# EasyEDA Pro project ProPrj_Arduino_Contest_2025_2025-11-19.epro, board Hub_Module_Rev_0
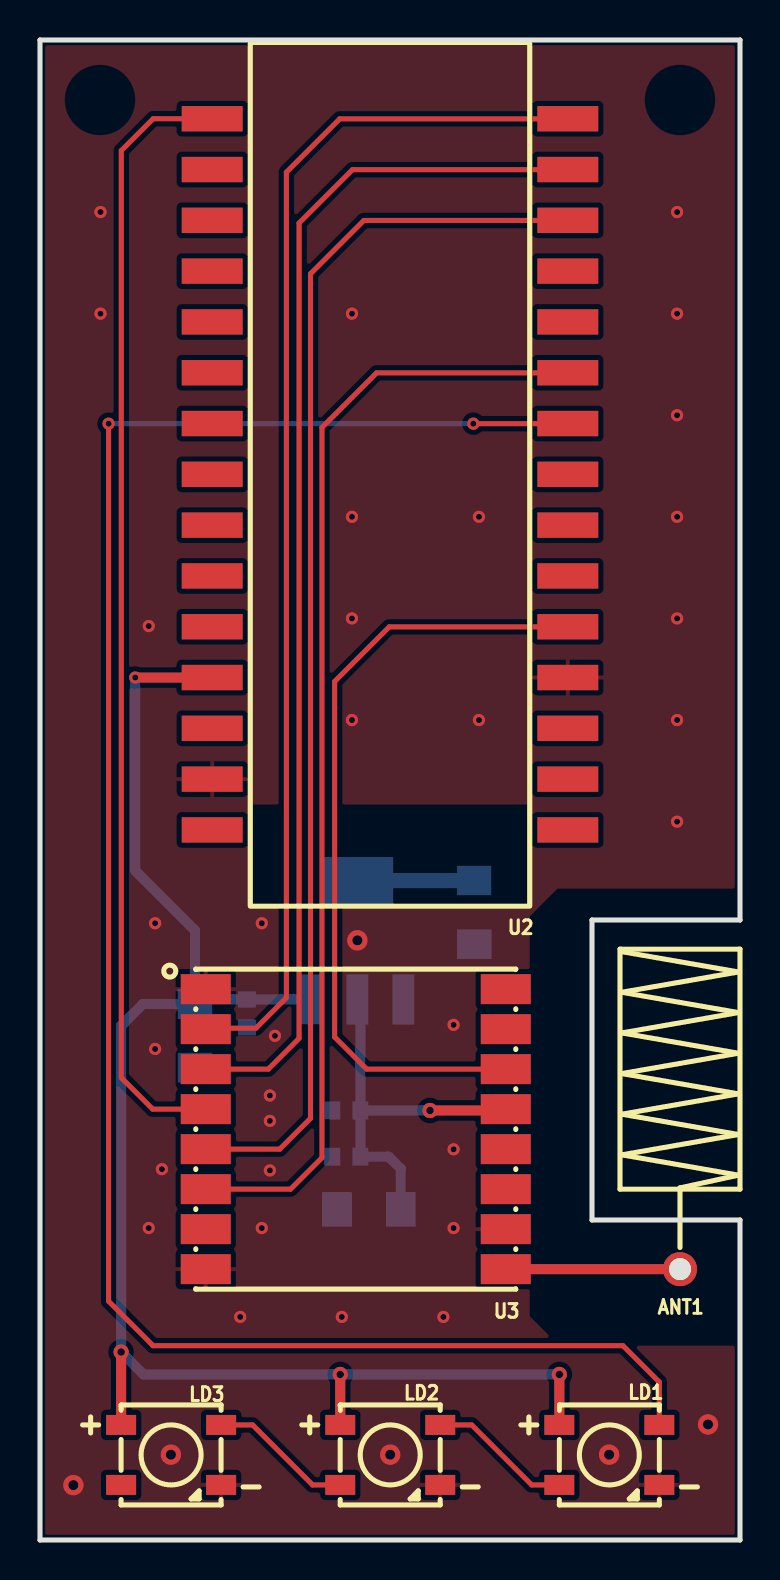
[diagram p25: board, top side]
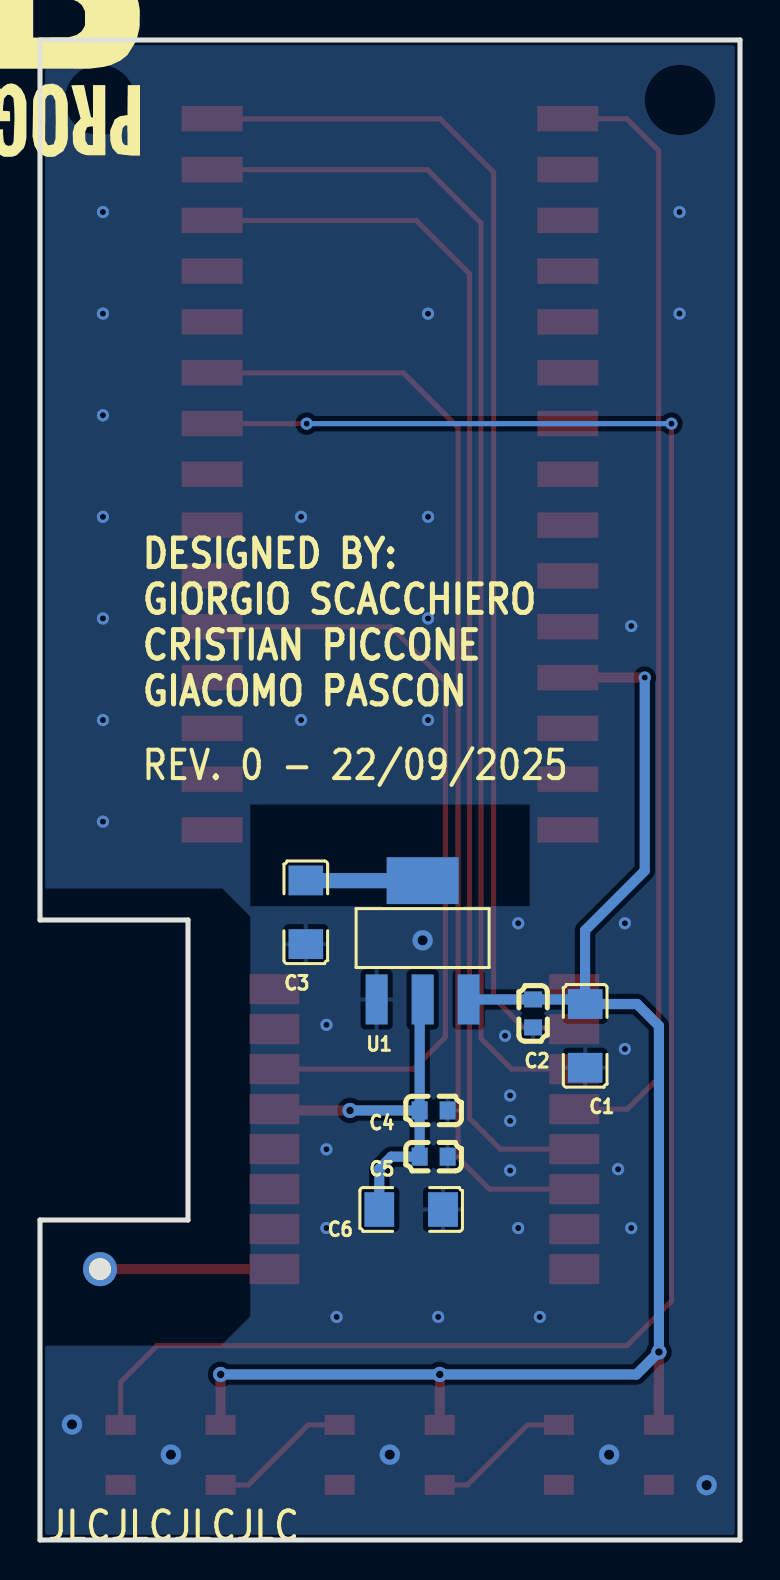
[diagram p26: board, bottom side, seen from below]

Outline 35 x 75 mm; copper layers: Top Layer, Bottom Layer. Coordinates in mm from the lower left corner of the outline.
Outline path: 0,75 35,75 35,31 27.6,31 27.6,16 35,16 35,0 0,0 0,75
Stack: Top Layer 0.035mm / Dielectric1 1.51mm FR4 er 4.5 / Bottom Layer 0.035mm

## Design rules (mm)
template: JLCPCB Capability(Two Layers Board)
spacing copperThickness1oz (default): track to track 0.102, other pairs 0.152 to 0.3
spacing copperThickness2oz: track to track 0.203, other pairs 0.152 to 0.3
track width copperThickness1oz (default): min 0.127, default 0.254, max 2.54
track width copperThickness2oz: min 0.203, default 0.254, max 2.54
differential pair differentialPair (default): width min 0.127, default 0.254, max 2.54; gap min 0.152, default 0.152
via viaSize (default): diameter min 0.5, default 0.61, max 10; hole min 0.3, default 0.305, max 6.3

## Placement (name value [footprint] x y rotation side)
ANT1  VG868SNX18-5W2  [ANT-TH_VG868SNX18-5W2]  32 13.54 90 top
C1  4.7uF  [C1206]  7.74 25.21 90 bottom
C2  100nF  [C0603]  10.34 26.33 90 bottom
C3  4.7uF  [C1206]  21.71 31.39 90 bottom
C4  100pF  [C0603]  15.32 21.48 0 bottom
C5  100nF  [C0603]  15.32 19.17 0 bottom
C6  4.7uF  [C1206]  16.44 16.53 0 bottom
LD1  XL-5050RGBC-WS2812B  [LED-SMD_4P-L5.0-W5.0-BL_XL-5050RGBC]  28.47 4.25 270 top
LD2  XL-5050RGBC-WS2812B  [LED-SMD_4P-L5.0-W5.0-BL_XL-5050RGBC]  17.51 4.25 270 top
LD3  XL-5050RGBC-WS2812B  [LED-SMD_4P-L5.0-W5.0-BL_XL-5050RGBC]  6.56 4.25 270 top
U1  AMS1117-3.3(XBLW)  [SOT-223-3_L6.5-W3.4-P2.30-LS7.0-BR-1]  15.87 30 270 bottom
U2  -  [Arduino_NANO_ESP32]  9.88 71.7 0 top
U3  868MHz  [COMM-SMD_LORA1276-C1-915MHZ]  15.79 20.54 0 top

## Footprints (pads in the part's own frame, mm; a bottom-side part is the same pattern mirrored in y, then rotated)
ANT-TH_VG868SNX18-5W2
  round 1.7 hole 1.1: 1(0,0)
Arduino_NANO_ESP32
  rect 3.048x1.27 smd: 1(-1.27,-0.635) 2(-1.27,-3.175) 3(-1.27,-5.715) 4(-1.27,-8.255) 5(-1.27,-10.795) 6(-1.27,-13.335) 7(-1.27,-15.875) 8(-1.27,-18.415) 9(-1.27,-20.955) 10(-1.27,-23.495) 11(-1.27,-26.035) 12(-1.27,-28.575) 13(-1.27,-31.115) 14(-1.27,-33.655) 15(-1.27,-36.195) 16(16.51,-0.635) 17(16.51,-3.175) 18(16.51,-5.715) 19(16.51,-8.255) 20(16.51,-10.795) 21(16.51,-13.335) 22(16.51,-15.875) 23(16.51,-18.415) 24(16.51,-20.955) 25(16.51,-23.495) 26(16.51,-26.035) 27(16.51,-28.575) 28(16.51,-31.115) 29(16.51,-33.655) 30(16.51,-36.195)
C0603
  rect 0.8x0.9 smd: 1(-0.7,0) 2(0.7,0)
C1206
  rect 1.485x1.728 smd: 1(-1.593,0) 2(1.593,0)
COMM-SMD_LORA1276-C1-915MHZ
  rect 2.5x1.5 smd: 1(-7.5,7) 2(-7.5,5) 3(-7.5,3) 4(-7.5,1) 5(-7.5,-1) 6(-7.5,-3) 7(-7.5,-5) 8(-7.5,-7) 9(7.5,-7) 10(7.5,-5) 11(7.5,-3) 12(7.5,-1) 13(7.5,1) 14(7.5,3) 15(7.5,5) 16(7.5,7)
LED-SMD_4P-L5.0-W5.0-BL_XL-5050RGBC
  rect 1x1.5 smd: 1(-1.5,-2.5) 2(1.5,-2.5) 3(1.5,2.5) 4(-1.5,2.5)
SOT-223-3_L6.5-W3.4-P2.30-LS7.0-BR-1
  rect 2.5x1.1 smd: 1(2.97,-2.3) 2(2.97,0) 3(2.97,2.3)
  rect 2.34x3.6 smd: 2(-2.97,0)

## Nets
As in the schematic.

Pads without a net: LD3 2; U2 3 4 5 6 7 8 9 10 11 13 15 19 20 23 24 25 28 29 30; U3 7 11 12 15 16

## Via types
v1: diameter 0.762, hole 0.381, Top Layer to Bottom Layer, 4 vias
v2: diameter 0.61, hole 0.305, Top Layer to Bottom Layer, 35 vias
v3: diameter 1.016, hole 0.508, Top Layer to Bottom Layer, 6 vias

## Routing (per net, layer and track width the routed paths; a pad name or vN(x,y) marks a point on that pad's centre or on a via; arc(x,y) is an arc through that point)
+3V3_REG: length 25.4
  Top Layer w0.508: U3.13 23.22,21.48 v1(19.5,21.48)
  Bottom Layer w0.508: U1.2 16.02,26.88 16.02,21.48 ; 16.02,21.48 v1(19.5,21.48) ; 16.02,21.48 16.02,19.17 17.43,19.17 18.03,18.57 C6.2
  Bottom Layer w0.762: C3.2 21.7,32.97 U1.2
+5V_USB: length 78.9
  Top Layer w0.508: LD3.1 v1(4.06,9.4) ; 25.96,5.75 LD1.1 25.97,8.28 ; 8.61,43.12 v2(4.76,43.12) ; LD2.1 v1(15.01,8.28)
  Bottom Layer w0.508: C1.2 5.15,26.8 4.06,25.71 v1(4.06,9.4) 5.18,8.28 v1(15.01,8.28) v1(25.97,8.28) ; 7.75,26.8 7.75,30.48 4.76,33.46 v2(4.76,43.12) ; U1.3 10.35,27.03 C2.2 7.97,27.03
  Bottom Layer w0.762: 7.97,27.03 7.75,26.8 C1.2
GND:
  vias: v2(3.03,66.4) v2(3.03,61.32) v2(5.44,45.7) v2(5.44,15.6) v2(5.76,30.84) v2(5.76,24.55) v2(6.1,18.54) v2(10.01,11.15) v2(11.09,30.84) v2(11.09,15.6) v2(11.49,22.22) v2(11.49,20.95) v2(11.49,18.48) v2(11.75,25.21) v2(15.09,11.15) v2(15.6,61.32) v2(15.6,51.16) v2(15.6,46.08) v2(15.6,41) v2(20.17,11.15) v2(20.68,25.76) v2(20.68,19.53) v2(20.68,15.6) v2(21.95,51.16) v2(21.95,41) v2(31.85,66.4) v2(31.85,61.32) v2(31.85,56.24) v2(31.85,51.16) v2(31.85,46.08) v2(31.85,41) v2(31.85,35.92) v3(1.67,2.74) v3(6.54,4.27) v3(15.87,29.98) v3(17.51,4.27) v3(28.46,4.27) v3(33.4,5.78)
#LORA_RES: length 56.4
  Top Layer w0.254: U2.21 26.38,58.36 16.83,58.36 14.1,55.63 14.1,19.11 12.53,17.54 U3.6
CS: length 62.1
  Top Layer w0.254: U3.5 11.99,19.54 13.53,21.08 13.53,63.31 16.19,65.98 26.32,65.98 26.33,65.98 26.39,65.98
LED_BUS: length 98.2
  Top Layer w0.254: v2(3.43,55.82) 3.43,11.94 5.65,9.72 29.15,9.72 30.97,7.9 LD1.4 ; v2(21.67,55.82) 26.38,55.82 U2.22
  Bottom Layer w0.254: v2(21.67,55.82) v2(3.43,55.82)
MISO: length 61.1
  Top Layer w0.254: U3.2 8.34,25.59 10.79,25.59 12.32,27.11 12.32,68.39 14.99,71.06 26.38,71.06 26.39,71.06
MOSI: length 60.6
  Top Layer w0.254: U3.3 11.41,23.54 12.95,25.08 12.95,65.85 15.62,68.52 26.38,68.52 U2.17
RX_INTR: length 39.8
  Top Layer w0.254: U2.26 26.38,45.66 17.46,45.66 14.73,42.93 14.73,25.15 16.34,23.54 U3.14
SCK: length 56.4
  Top Layer w0.254: U3.4 5.63,21.54 4.06,23.11 4.06,69.47 5.66,71.06 8.61,71.06
$2N825: length 8.5
  Top Layer w0.508: 23.49,13.54 ANT1.1
$2N1751: length 7.2
  Top Layer w0.254: LD2.4 21.58,5.75 24.58,2.75 LD1.2
$2N1765: length 7.2
  Top Layer w0.254: LD3.4 10.63,5.75 13.63,2.75 LD2.2

## Copper pours and planes (outline as drawn; the poured copper is in the pictures)
GND on Top Layer: 25.96,9.72 35,9.72 35,0 0,0 0,75 35,75 35,32.57 25.88,32.57 24.49,31.18 24.49,11.19
GND on Bottom Layer: 25.96,9.72 35,9.72 35,0 0,0 0,75 35,75 35,32.57 25.88,32.57 24.49,31.18 24.49,11.19

## Text on the board
Bottom Silkscreen Layer: REV. 0 - 22/09/2025 | JLCJLCJLCJLC | DESIGNED BY: / GIORGIO SCACCHIERO / CRISTIAN PICCONE / GIACOMO PASCON
